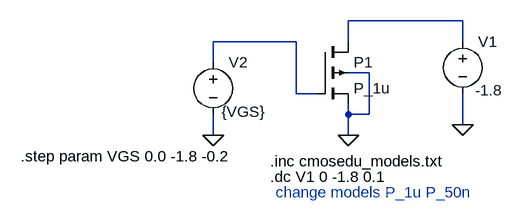
[diagram p0: schematic PMOS_Char1.asc]
PMOS_Char1.asc, the LTspice schematic file:
Version 4.1
SHEET 1 880 680
WIRE 352 96 176 96
WIRE 96 128 -32 128
WIRE 176 128 176 96
WIRE 352 128 352 96
WIRE -32 160 -32 128
WIRE 208 176 176 176
WIRE 96 208 96 128
WIRE 128 208 96 208
WIRE 176 240 176 224
WIRE 208 240 208 176
WIRE 208 240 176 240
WIRE 352 256 352 208
WIRE -32 272 -32 240
WIRE 176 272 176 240
FLAG -32 272 0
FLAG 352 256 0
FLAG 176 272 0
SYMBOL pmos4 128 128 R0
SYMATTR InstName P1
SYMATTR Value P_1u
SYMBOL voltage 352 112 R0
WINDOW 3 19 91 Left 2
WINDOW 123 0 0 Left 0
WINDOW 39 0 0 Left 0
SYMATTR Value -1.8
SYMATTR InstName V1
SYMBOL voltage -32 144 R0
WINDOW 3 13 92 Left 2
WINDOW 123 0 0 Left 0
WINDOW 39 0 0 Left 0
SYMATTR Value {VGS}
SYMATTR InstName V2
TEXT 56 312 Left 2 !.inc cmosedu_models.txt
TEXT 56 336 Left 2 !.dc V1 0 -1.8 0.1
TEXT 64 360 Left 2 ;change models P_1u P_50n
TEXT -328 304 Left 2 !.step param VGS 0.0 -1.8 -0.2

The netlist it stands for:
* PMOS_Char1.asc
M§P1 N001 N002 0 0 P_1u
V1 N001 0 -1.8
V2 N002 0 {VGS}
.model NMOS NMOS
.model PMOS PMOS
.lib standard.mos
.inc cmosedu_models.txt
.dc V1 0 -1.8 0.1
* change models P_1u P_50n
.step param VGS 0.0 -1.8 -0.2
.backanno
.end